# EAGLE schematic QTPyNoisyBoi_PTH (EAGLE 9.6.2)
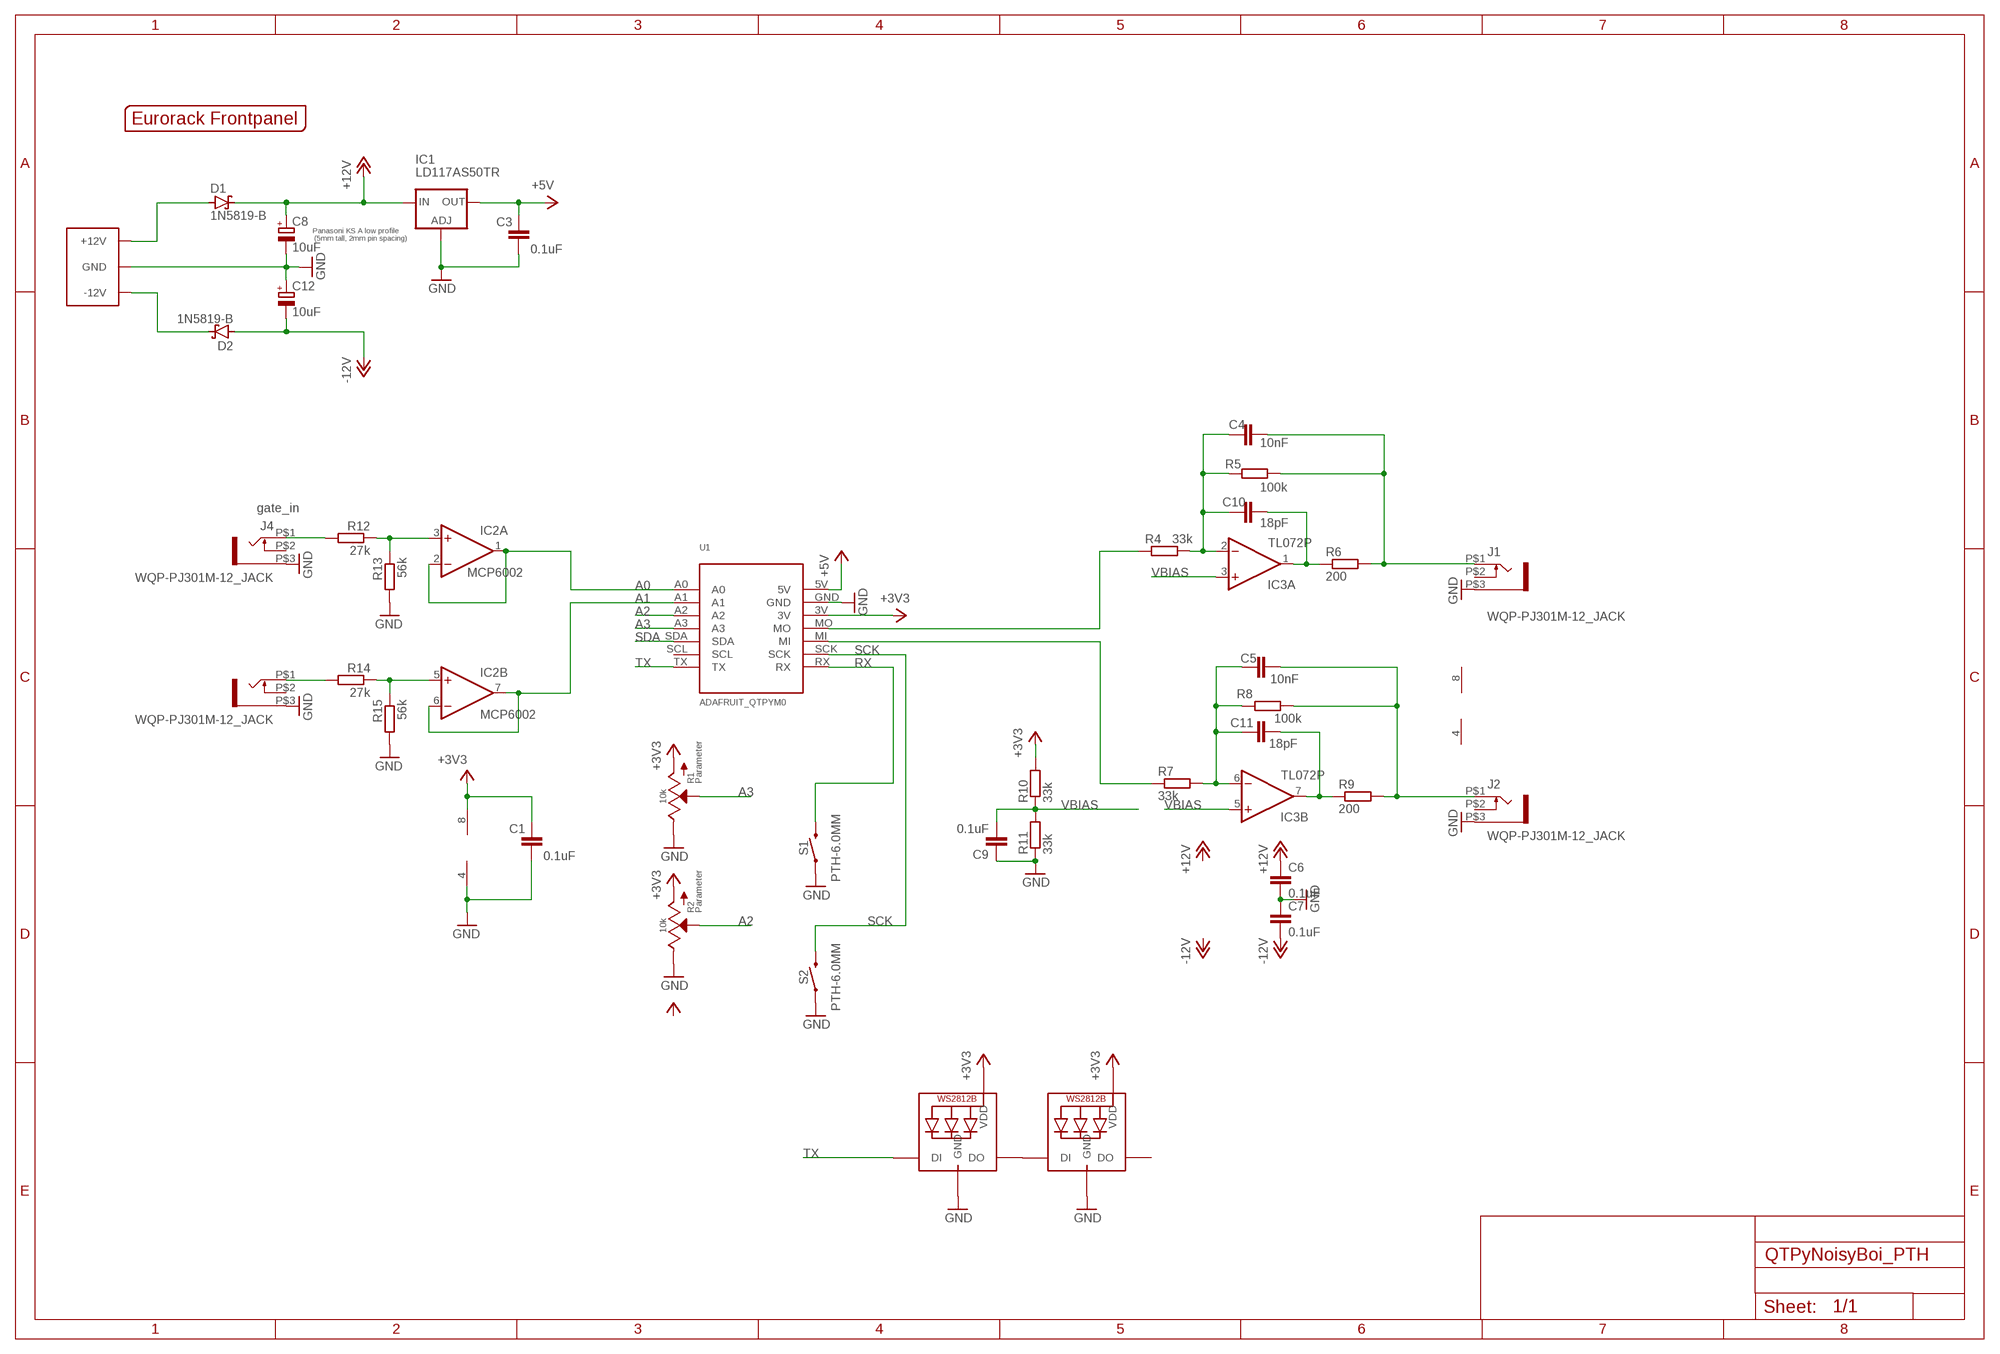
[diagram p0: schematic, sheet 1]

## Parts
C1  0.1uF  C-EU025-024X044  [C025-024X044]
C3  0.1uF  C-EU025-024X044  [C025-024X044]
C4  10nF  C-EU025-024X044  [C025-024X044]
C5  10nF  C-EU025-024X044  [C025-024X044]
C6  0.1uF  C-EU025-024X044  [C025-024X044]
C7  0.1uF  C-EU025-024X044  [C025-024X044]
C8  10uF  CPOL-EUE2-5  [E2-5]
C9  0.1uF  C-EU025-024X044  [C025-024X044]
C10  18pF  C-EU025-024X044  [C025-024X044]
C11  18pF  C-EU025-024X044  [C025-024X044]
C12  10uF  CPOL-EUE2-5  [E2-5]
D1  1N5819-B  [DO41-7.6]
D2  1N5819-B  [DO41-7.6]
DIM1  EURO_POWER_LOCKSKINNY  [EURO_POWER_HEADER]
IC1  LD117AS50TR  [SOT223]
IC2  MCP6002  TL072P  [DIL08]
IC3  TL072P  [DIL08]
J1  WQP-PJ301M-12_JACK  [WQP-PJ301M-12_JACK]
J2  WQP-PJ301M-12_JACK  [WQP-PJ301M-12_JACK]
J3  WQP-PJ301M-12_JACK  [WQP-PJ301M-12_JACK]
J4  WQP-PJ301M-12_JACK  [WQP-PJ301M-12_JACK]
LED1  WS2812B5MM_TH  [WS2812_THRUHOLE]
LED2  WS2812B5MM_TH  [WS2812_THRUHOLE]
R1  10k  POTZEPHPOT  [OG-POTS_ALPS_POT_VERTICAL]
R2  10k  POTZEPHPOT  [OG-POTS_ALPS_POT_VERTICAL]
R4  33k  R-EU_0204/2V  [0204V]
R5  100k  R-EU_0204/2V  [0204V]
R6  200  R-EU_0204/2V  [0204V]
R7  33k  R-EU_0204/2V  [0204V]
R8  100k  R-EU_0204/2V  [0204V]
R9  200  R-EU_0204/2V  [0204V]
R10  33k  R-EU_0204/2V  [0204V]
R11  33k  R-EU_0204/2V  [0204V]
R12  27k  R-EU_0204/2V  [0204V]
R13  56k  R-EU_0204/2V  [0204V]
R14  27k  R-EU_0204/2V  [0204V]
R15  56k  R-EU_0204/2V  [0204V]
S1  PTH-6.0MM  MOMENTARY-SWITCH-SPST-PTH-6.0MM  [TACTILE_SWITCH_PTH_6.0MM]
S2  PTH-6.0MM  MOMENTARY-SWITCH-SPST-PTH-6.0MM  [TACTILE_SWITCH_PTH_6.0MM]
U1  ADAFRUIT_QTPYM0  [ADAFRUIT_QTPY_M0]
U$1  EURORACK_PANEL6HP  [EURORACK6HPPANEL]

## Nets
+3V3: C1.2 IC2.8(P:V+) LED1.V(VDD) LED2.V(VDD) R1.P$3(A) R2.P$3(A) R10.2 U1.3V
+5V: C3.2 IC1.4(OUT) U1.5V
+12V: C6.1 C8.+ D1.C IC1.3(IN)
-12V: C7.2 C12.- D2.A
A0: IC2.1(A:OUT) IC2.2(A:-IN) U1.A0
A1: IC2.6(B:-IN) IC2.7(B:OUT) U1.A1
A2: R2.P$2(S) U1.A2
A3: R1.P$2(S) U1.A3
GND: C1.1 C3.1 C6.2 C7.1 C8.- C9.1 C12.+ DIM1.3(GND) DIM1.4(GND) DIM1.5(GND) DIM1.6(GND) DIM1.7(GND) DIM1.8(GND) IC1.1(ADJ) IC2.4(P:V-) J1.P$3 J2.P$3 J3.P$3 J4.P$3 LED1.GND LED2.GND R1.P$1(E) R2.P$1(E) R11.1 R13.2 R15.2 S1.1 S2.1 U1.GND
N$1: C5.2 J2.P$1 R8.2 R9.2
N$2: LED1.DO LED2.DI
N$3: IC2.3(A:+IN) R12.1 R13.1
N$4: J4.P$1 R12.2
N$6: R4.1 U1.MO
N$7: R7.1 U1.MI
N$8: IC2.5(B:+IN) R14.1 R15.1
N$9: C4.2 J1.P$1 R5.2 R6.2
N$10: C4.1 C10.1 IC3.2(A:-IN) R4.2 R5.1
N$12: D2.C DIM1.1(-12V) DIM1.2(-12V)
N$13: C5.1 C11.1 IC3.6(B:-IN) R7.2 R8.1
N$14: C11.2 IC3.7(B:OUT) R9.1
N$17: D1.A DIM1.9(+12V) DIM1.10(+12V)
N$18: C10.2 IC3.1(A:OUT) R6.1
N$19: J3.P$1 R14.2
RX: S1.3 U1.RX
SCK: S2.3 U1.SCK
SDA: U1.SDA
TX: LED1.DI U1.TX
VBIAS: C9.2 IC3.3(A:+IN) IC3.5(B:+IN) R10.1 R11.2
Unconnected: J1.P$2 J2.P$2 J3.P$2 J4.P$2 LED2.DO U1.SCL

## Notes on the sheet
- Panasoni KS A low profile
   (5mm tall, 2mm pin spacing)
- gate_in

## Power pins joined to a net without a drawn wire
V+: IC3.8(P:V+)
V-: IC3.4(P:V-)

## Library data of the parts
C1 C3-C7 C9-C11 = rcl:C-EU: CAPACITOR, European symbol; SPICEPREFIX: C
C8 C12 = rcl:CPOL-EU: POLARIZED CAPACITOR, European symbol; SPICEPREFIX: C
D1 D2 = diode:1N581*: 1.0A SCHOTTKY BARRIER RECTIFIER Source: http://www.diodes.com/datasheets/ds23001.pdf
DIM1 = MusicThingModular:EURO_POWER_LOCK
IC1 = v-reg:LD117A?*: Low drop fixed and adjustable positive voltage regulators 1 A Source: http://www.st.com/stonline/products/literature/ds/7194/ld1117axx.pdf
IC2 IC3 = linear:TL072: OP AMP
J1-J4 = thonkiconn:WQP-PJ301M-12_JACK
LED1 LED2 = todstuff:WS2812B
R1 R2 = EurorackModularParts:POT; DESC: Parameter
R4-R15 = rcl:R-EU_: RESISTOR, European symbol; SPICEPREFIX: R
S1 S2 = SparkFun-Switches:MOMENTARY-SWITCH-SPST: Momentary Switch (Pushbutton) - SPST Normally-open (NO) SPST momentary switches (buttons, pushbuttons). Variants PTH-12MM - 12mm square, through-hole Momentary Pushbutton Switch - 12mm Square <https://www.sparkfun.com/products/9190> (COM-09190) PTH-6.0MM, PTH-6.0MM-KIT - 6.0mm square, through-hole Mini Pushbutton Switch <https://www.sparkfun.com/products/97> (COM-00097) KIT package intended for soldering kit's - only one side of pads' copper is exposed. PTH-RIGHT-ANGLE-KIT - Right-angle, through-hole Right Angle Tactile Button <https://www.sparkfun.com/products/10791> - Used on SparkFun BigTime Watch Kit <https://www.sparkfun.com/products/11734> SMD-12MM - 12mm square, surface-mount Tactile Button - SMD (12mm) <https://www.sparkfun.com/products/12993> (COM-12993) Used on SparkFun PicoBoard <https://www.sparkfun.com/products/11888> SMD-4.5MM - 4.5mm Square Trackball Switch Used on SparkFun Blackberry Trackballer Breakout <https://www.sparkfun.com/products/13169> SMD-4.6MMX2.8MM - 4.60mm x 2.80mm, surface mount Used on SparkFun SAMD21 Mini Breakout <https://www.sparkfun.com/products/13664> SMD-5.2MM, SMD-5.2-REDUNDANT - 5.2mm square, surface-mount Mini Pushbutton Switch - SMD <https://www.sparkfun.com/products/8720> (COM-08720) Used on Arduino Pro Mini <https://www.sparkfun.com/products/11114> REDUNDANT package connects both switch circuits together SMD-6.0X3.5MM - 6.0 x 3.5mm, surface mount Momentary Reset Switch SMD <https://www.sparkfun.com/products/8229> (COM-08229) SMD-6.2MM-TALL - 6.2mm square, surface mount Tactile Button - SMD (6mm) <https://www.sparkfun.com/products/12992> Used on SparkFun Digital Sandbox <https://www.sparkfun.com/products/12651> SMD-RIGHT-ANGLE - Right-angle, surface mount Used on SparkFun Block for Intel® Edison - Arduino <https://www.sparkfun.com/products/13036>; PROD_ID: SWCH-08441; SF_SKU: COM-00097
U1 = todstuff:ADAFRUIT_QTPY
U$1 = EurorackModularParts:EURORACK_PANEL